# EAGLE schematic 20190213 (EAGLE 9.2.2)
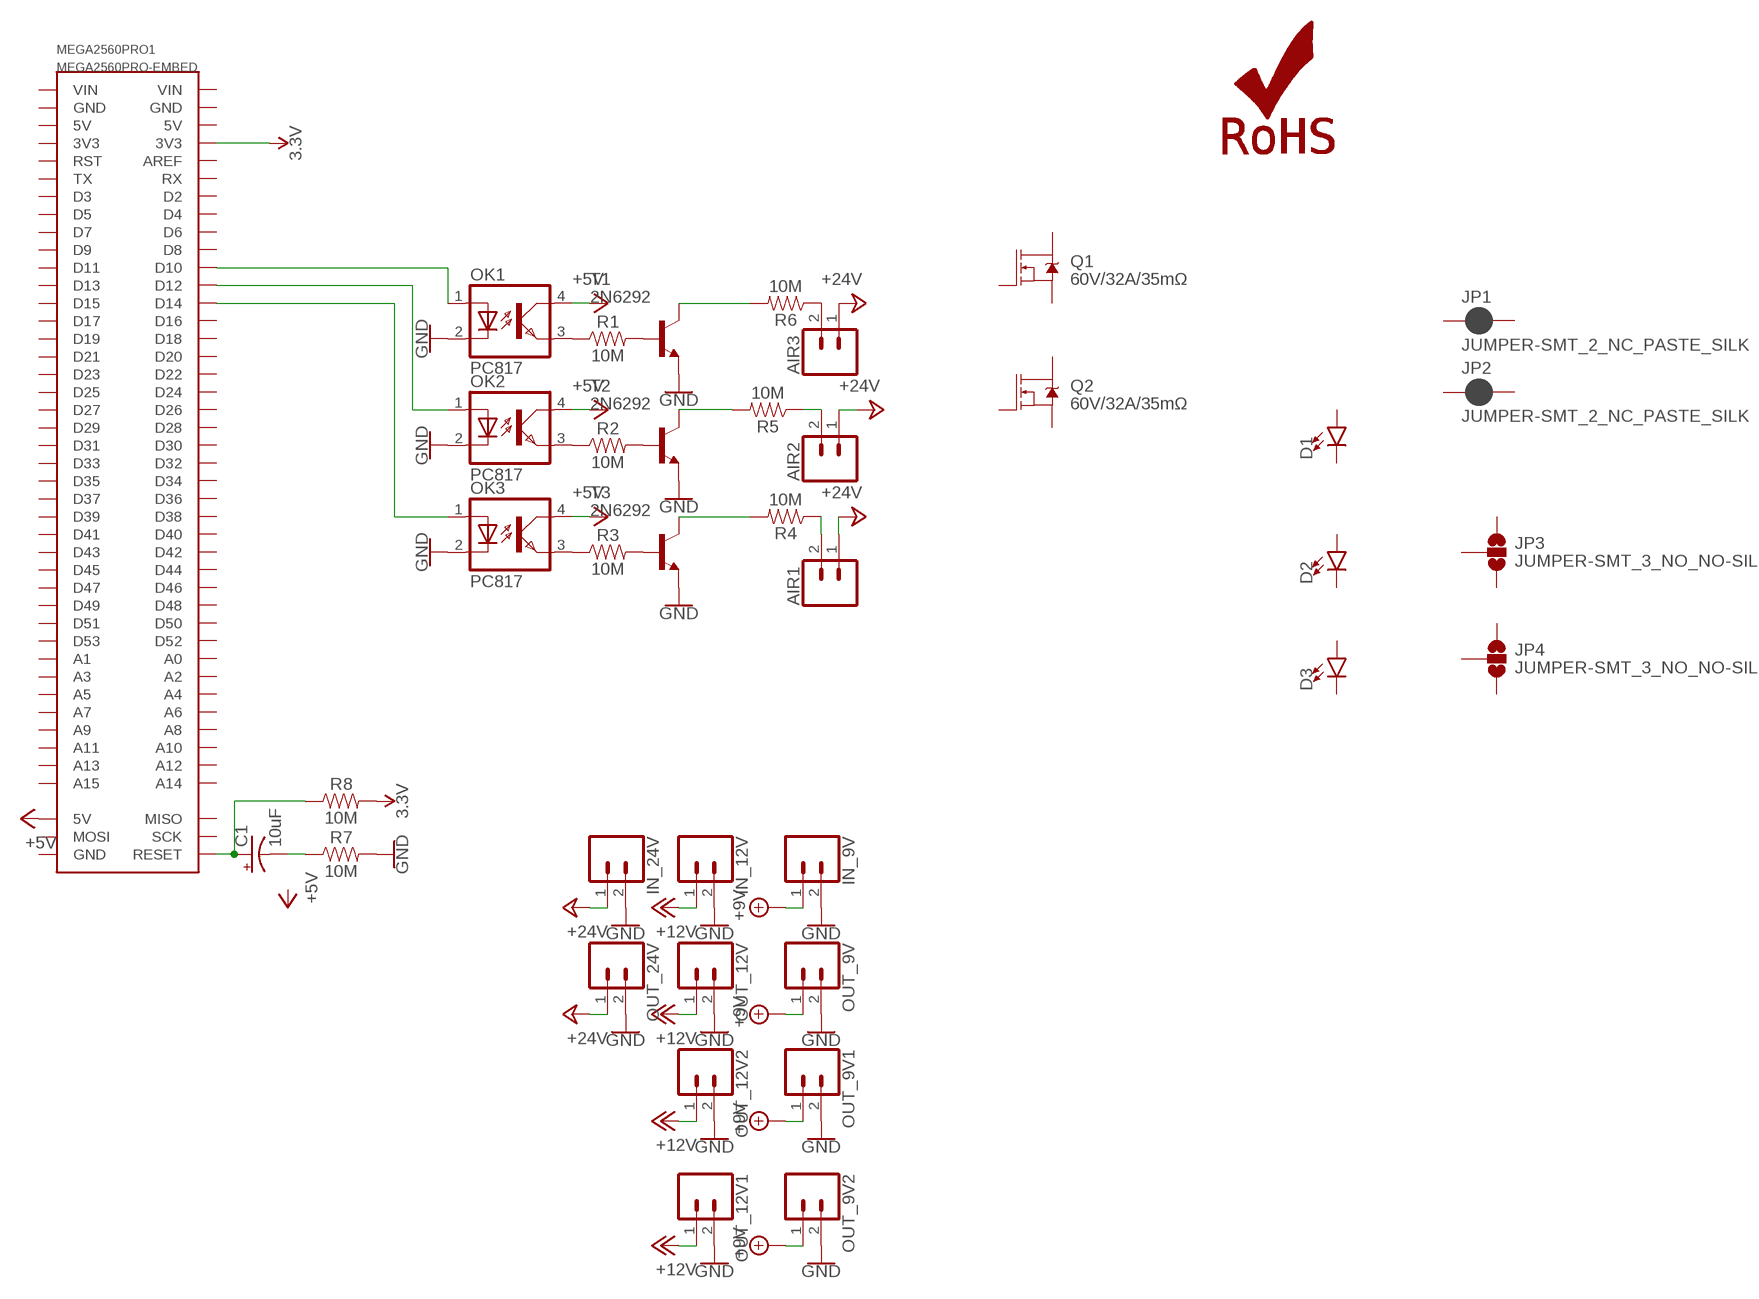
[diagram p0: schematic, sheet 1]

## Parts
AIR1  CONN_02POLAR_LOCK  [MOLEX-1X2_LOCK]
AIR2  CONN_02POLAR_LOCK  [MOLEX-1X2_LOCK]
AIR3  CONN_02POLAR_LOCK  [MOLEX-1X2_LOCK]
C1  10uF  10UF-POLAR-RADIAL-2.5MM-KIT-25V-20%  [CPOL-RADIAL-2.5MM-5MM-KIT]
D1  LED5MM  [LED_5MM]
D2  LED5MM  [LED_5MM]
D3  LED5MM  [LED_5MM]
IN_9V  CONN_02POLAR_LOCK  [MOLEX-1X2_LOCK]
IN_12V  CONN_02POLAR_LOCK  [MOLEX-1X2_LOCK]
IN_24V  CONN_02POLAR_LOCK  [MOLEX-1X2_LOCK]
JP1  JUMPER-SMT_2_NC_PASTE_SILK  [SMT-JUMPER_2_NC_PASTE_SILK]
JP2  JUMPER-SMT_2_NC_PASTE_SILK  [SMT-JUMPER_2_NC_PASTE_SILK]
JP3  JUMPER-SMT_3_NO_NO-SILK  [SMT-JUMPER_3_NO_NO-SILK]
JP4  JUMPER-SMT_3_NO_NO-SILK  [SMT-JUMPER_3_NO_NO-SILK]
LOGO1  ROHS_LOGO  [ROHS_LOGO_0.18_IN]
MEGA2560PRO1  MEGA2560PRO-EMBED  [MEGA2560PRO-EMBED]
OK1  PC817  [DIL04]
OK2  PC817  [DIL04]
OK3  PC817  [DIL04]
OUT_9V  CONN_02POLAR_LOCK  [MOLEX-1X2_LOCK]
OUT_9V1  CONN_02POLAR_LOCK  [MOLEX-1X2_LOCK]
OUT_9V2  CONN_02POLAR_LOCK  [MOLEX-1X2_LOCK]
OUT_12V  CONN_02POLAR_LOCK  [MOLEX-1X2_LOCK]
OUT_12V1  CONN_02POLAR_LOCK  [MOLEX-1X2_LOCK]
OUT_12V2  CONN_02POLAR_LOCK  [MOLEX-1X2_LOCK]
OUT_24V  CONN_02POLAR_LOCK  [MOLEX-1X2_LOCK]
Q1  60V/32A/35mΩ  MOSFET-NCH-FQP30N06L  [TO220V]
Q2  60V/32A/35mΩ  MOSFET-NCH-FQP30N06L  [TO220V]
R1  10M  10MOHM-HORIZ-1/4W-5%  [AXIAL-0.3]
R2  10M  10MOHM-HORIZ-1/4W-5%  [AXIAL-0.3]
R3  10M  10MOHM-HORIZ-1/4W-5%  [AXIAL-0.3]
R4  10M  10MOHM-HORIZ-1/4W-5%  [AXIAL-0.3]
R5  10M  10MOHM-HORIZ-1/4W-5%  [AXIAL-0.3]
R6  10M  10MOHM-HORIZ-1/4W-5%  [AXIAL-0.3]
R7  10M  10MOHM-HORIZ-1/4W-5%  [AXIAL-0.3]
R8  10M  10MOHM-HORIZ-1/4W-5%  [AXIAL-0.3]
T1  2N6292  [TO220]
T2  2N6292  [TO220]
T3  2N6292  [TO220]

## Nets
3.3V: MEGA2560PRO1.3V3@2(3V3) R8.P$2
+5V: MEGA2560PRO1.5V@3(5V) OK1.4(COL) OK2.4(COL) OK3.4(COL)
+9V: IN_9V.1 OUT_9V1.1 OUT_9V2.1 OUT_9V.1
+12V: IN_12V.1 OUT_12V1.1 OUT_12V2.1 OUT_12V.1
+24V: AIR1.1 AIR2.1 AIR3.1 IN_24V.1 OUT_24V.1
GND: IN_9V.2 IN_12V.2 IN_24V.2 OK1.2(C) OK2.2(C) OK3.2(C) OUT_9V1.2 OUT_9V2.2 OUT_9V.2 OUT_12V1.2 OUT_12V2.2 OUT_12V.2 OUT_24V.2 R7.P$2 T1.3(E) T2.3(E) T3.3(E)
N$1: R1.P$2 T1.1(B)
N$2: R2.P$2 T2.1(B)
N$3: R3.P$2 T3.1(B)
N$4: AIR1.2 R4.P$1
N$5: AIR2.2 R5.P$1
N$6: AIR3.2 R6.P$1
N$7: OK1.3(EMIT) R1.P$1
N$8: OK2.3(EMIT) R2.P$1
N$9: OK3.3(EMIT) R3.P$1
N$10: R6.P$2 T1.2(C)
N$11: R5.P$2 T2.2(C)
N$12: R4.P$2 T3.2(C)
N$13: C1.1(+) MEGA2560PRO1.RESET R8.P$1
N$14: C1.2(-) R7.P$1
N$15: MEGA2560PRO1.D10 OK1.1(A)
N$16: MEGA2560PRO1.D12 OK2.1(A)
N$17: MEGA2560PRO1.D14 OK3.1(A)
Unconnected: D1.A D1.K(C) D2.A D2.K(C) D3.A D3.K(C) JP1.1 JP1.2 JP2.1 JP2.2 JP3.1 JP3.2 JP3.3 JP4.1 JP4.2 JP4.3 MEGA2560PRO1.3V3@1(3V3) MEGA2560PRO1.5V@1(5V) MEGA2560PRO1.5V@2(5V) MEGA2560PRO1.A0 MEGA2560PRO1.A1 MEGA2560PRO1.A2 MEGA2560PRO1.A3 MEGA2560PRO1.A4 MEGA2560PRO1.A5 MEGA2560PRO1.A6 MEGA2560PRO1.A7 MEGA2560PRO1.A8 MEGA2560PRO1.A9 MEGA2560PRO1.A10 MEGA2560PRO1.A11 MEGA2560PRO1.A12 MEGA2560PRO1.A13 MEGA2560PRO1.A14 MEGA2560PRO1.A15 MEGA2560PRO1.AREF MEGA2560PRO1.D2 MEGA2560PRO1.D3 MEGA2560PRO1.D4 MEGA2560PRO1.D5 MEGA2560PRO1.D6 MEGA2560PRO1.D7 MEGA2560PRO1.D8 MEGA2560PRO1.D9 MEGA2560PRO1.D11 MEGA2560PRO1.D13 MEGA2560PRO1.D15 MEGA2560PRO1.D16 MEGA2560PRO1.D17 MEGA2560PRO1.D18 MEGA2560PRO1.D19 MEGA2560PRO1.D20 MEGA2560PRO1.D21 MEGA2560PRO1.D22 MEGA2560PRO1.D23 MEGA2560PRO1.D24 MEGA2560PRO1.D25 MEGA2560PRO1.D26 MEGA2560PRO1.D27 MEGA2560PRO1.D28 MEGA2560PRO1.D29 MEGA2560PRO1.D30 MEGA2560PRO1.D31 MEGA2560PRO1.D32 MEGA2560PRO1.D33 MEGA2560PRO1.D34 MEGA2560PRO1.D35 MEGA2560PRO1.D36 MEGA2560PRO1.D37 MEGA2560PRO1.D38 MEGA2560PRO1.D39 MEGA2560PRO1.D40 MEGA2560PRO1.D41 MEGA2560PRO1.D42 MEGA2560PRO1.D43 MEGA2560PRO1.D44 MEGA2560PRO1.D45 MEGA2560PRO1.D46 MEGA2560PRO1.D47 MEGA2560PRO1.D48 MEGA2560PRO1.D49 MEGA2560PRO1.D50 MEGA2560PRO1.D51 MEGA2560PRO1.D52 MEGA2560PRO1.D53 MEGA2560PRO1.GND@1(GND) MEGA2560PRO1.GND@2(GND) MEGA2560PRO1.GND@3(GND) MEGA2560PRO1.MISO MEGA2560PRO1.MOSI MEGA2560PRO1.RST MEGA2560PRO1.RX MEGA2560PRO1.SCK MEGA2560PRO1.TX MEGA2560PRO1.VIN@1(VIN) MEGA2560PRO1.VIN@2(VIN) Q1.1(G) Q1.2(D) Q1.3(S) Q2.1(G) Q2.2(D) Q2.3(S)

## Library data of the parts
AIR1-AIR3 IN_9V IN_12V IN_24V OUT_9V OUT_9V1 OUT_9V2 OUT_12V OUT_12V1 OUT_12V2 OUT_24V = SparkFun-Connectors:CONN_02: Multi connection point. Often used as Generic Header-pin footprint for 0.1 inch spaced/style header connections On any of the 0.1 inch spaced packages, you can populate with these: Break Away Headers - Straight <https://www.sparkfun.com/products/116> (PRT-00116) Break Away Male Headers - Right Angle <https://www.sparkfun.com/products/553> (PRT-00553) Female Headers <https://www.sparkfun.com/products/115> (PRT-00115) Break Away Headers - Machine Pin <https://www.sparkfun.com/products/117> (PRT-00117) Break Away Female Headers - Swiss Machine Pin <https://www.sparkfun.com/products/743> (PRT-00743) For SCREWTERMINALS and SPRING TERMINALS visit here: Screw Terimnals on SparkFun.com <https://www.sparkfun.com/search/results?term=Screw+Terminals> (5mm/3.5mm/2.54mm spacing) This device is also useful as a general connection point to wire up your design to another part of your project. Our various solder wires solder well into these plated through hole pads. Hook-Up Wire - Assortment (Stranded, 22 AWG) <https://www.sparkfun.com/products/11375> (PRT-11375) Hook-Up Wire - Assortment (Solid Core, 22 AWG) <https://www.sparkfun.com/products/11367> (PRT-11367) View the entire wire category on our website here <https://www.sparkfun.com/categories/141> Special notes: Molex polarized connector foot print use with: PRT-08233 with associated crimp pins and housings. 2.54_SCREWTERM for use with PRT-10571. 3.5mm Screw Terminal footprints for PRT-08084 5mm Screw Terminal footprints for use with PRT-08432; SF_ID: PRT-09918
C1 = SparkFun-Capacitors:10UF-POLAR: 10.0µF polarized capacitors A capacitor is a passive two-terminal electrical component used to store electrical energy temporarily in an electric field.; PROD_ID: CAP-08440
D1-D3 = SparkFun-LED:LED: LED (Generic) Standard schematic elements and footprints for 5mm, 3mm, 1206, and 0603 sized LEDs. Generic LEDs with no color specified.
JP1 JP2 = SparkFun-Jumpers:JUMPER-SMT_2_NC_PASTE: Normally closed solder jumper This jumper has an aperture in the stencil to allow solder paste to bridge the split in the wire so it's normally closed (NC). Wick off the solder to open the connection. Reapply solder to reclose the connection.
JP3 JP4 = SparkFun-Jumpers:JUMPER-SMT_3_NO: Normally open jumper This jumper has three pads in close proximity to each other. Apply solder to close the connection(s).
LOGO1 = SparkFun-Aesthetics:ROHS_LOGO: Restriction of Hazardous Substances (RoHS) Logo Logo for RoHS-certified hardware.
MEGA2560PRO1 = robotdyn:MEGA2560PRO-EMBED: Robotdyn Robotdyn Mega 2560 PRO (Embed) https://robotdyn.com/mega-2560-pro-embed-ch340g-atmega2560-16au.html
OK1-OK3 = optocoupler:PC817: SHARP OPTO COUPLER; MPN: PC817X4J000F; OC_FARNELL: 9707727; OC_NEWARK: 97K7059
Q1 Q2 = SparkFun-DiscreteSemi:MOSFET-NCH: N-channel MOSFETs Voltage controlled devices that allow control of high current outputs. SparkFun Products: SparkFun OpenScale <https://www.sparkfun.com/products/13261> SparkFun Digital Sandbox <https://www.sparkfun.com/products/12651> SparkFun Monster Moto Shield <https://www.sparkfun.com/products/10182> SparkFun MOSFET Power Controller <https://www.sparkfun.com/products/11214>; PROD_ID: TRANS-10060
R1-R8 = SparkFun-Resistors:10MOHM: RES-09327; PROD_ID: RES-09327
T1-T3 = transistor:2N6292: NPN TRANSISTOR